# Altium schematic sheet 100068622_ideal_diode.SchDoc
size 863 x 558 mm; SheetNumber: 3; SheetTotal: 6
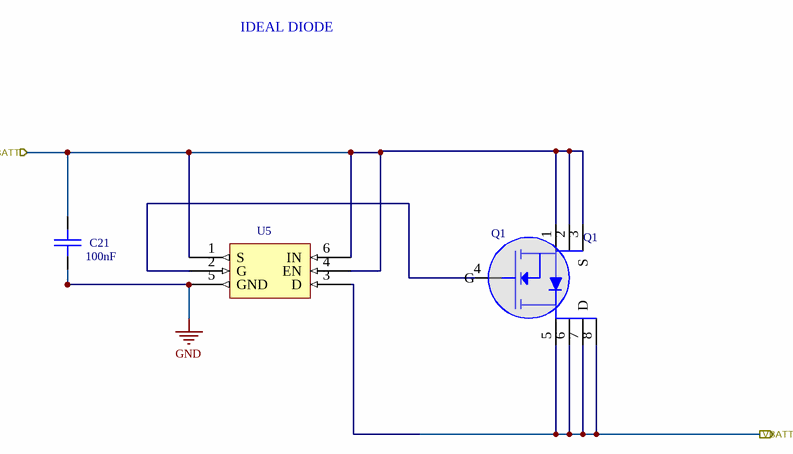
[diagram p0: 100068622_ideal_diode.SchDoc]

## Parts
C21  value 100nF  [CAP-0402-A]  (hidden comment: CAP 0402 0.1UF 50V 10% X5R)
Q1  MOSFET - SINGLE - N CHANNEL - 8PIN  [IC-8PQFN-A]  (value not drawn)
U5  NCV68261MTWAITBG  [IC-WDFN6-C]  (value not drawn)

## Ports
VBATT (in), VBATT_PROT (out)

## Nets
GND: C21.1 U5.5(GND)
VBATT: C21.2 Q1.1(S) Q1.2(S) Q1.3(S) U5.1(S) U5.4(EN) U5.6(IN) ; port VBATT
VBATT_PROT: Q1.5(D) Q1.6(D) Q1.7(D) Q1.8(D) U5.3(D) ; port VBATT_PROT
NetQ1_4: Q1.4(G) U5.2(G)

## Notes on the sheet
- IDEAL DIODE
- (near Q1) Q1
- DWG NO
- REVISIONS
- SH
- REVISION
- DESCRIPTION
- DATE(YEAR-MO-DA)
- APPROVED
- PART NO.
- DESIGN ACTIVITY
- US ARMY
  COMBAT CAPABILITIES DEVELOPMENT COMMAND ARMAMENTS CENTER
  PICATINNY ARSENAL, NEW JERSEY 07806-5000
- SIZE
- CAGE CODE
- DWG NO.
- D
- 19200
- SCALE
- NONE
- UNIT WT.
- ---
- SHEET

## Library data of the parts
C21 = CAP-00349-1: Capacitor Type: Ceramic; Leader Qty: 100; UOM: EA; Footprint: Capacitor_SMD:C_0402_1005Metric; Case/Package: 0402; Max Operating Temperature: 85°C; Min Operating Temperature: -55°C; Mounting Technology: Surface Mount; Pins: 2; RoHS Compliant: Yes; Tolerance: 10%; Voltage Rating: 50V
Q1 = CMP-00665-5: Transistor MOSFET N-Channel 40V 150A 8-Pin PQFN T/R; Manufacturer Lifecycle Status: ACTIVE; Drain to Source Resistance: 2.1mΩ; Gate to Source Voltage (Vgs): 20V; Max Junction Temperature (Tj): 150°C; Max Power Dissipation: 83W; Number of Channels: 1; Power Dissipation: 2.2W; Turn-Off Delay Time: 32ns; Turn-On Delay Time: 17ns; China RoHS: Non-Compliant; Continuous Drain Current (ID): 150A; Country of Origin: Philippines; Drain to Source Breakdown Voltage: 40V; Drain to Source Voltage (Vdss): 40V; Export Control Classification Number (ECCN) Code: EAR99; Height: 800µm; Introduction Date: 2019-11-12; Lifecycle Status: Production; Max Operating Temperature: 150°C; Min Breakdown Voltage: 40V; Min Operating Temperature: -55°C; Number of Elements: 1; Number of Terminals: 8; REACH SVHC: No; RoHS: Compliant; Schedule B: 8541290080, 8541290080
U5 = IC-00420-1: OR Controller N-Channel Single 2.4Ohm Automotive 6-Pin WDFNW EP T/R; Footprint: 1a_Misc:WDFNW6_2x2_0.65p_EP; China RoHS: Compliant; Export Control Classification Number (ECCN) Code: EAR99; Harmonized Tariff Schedule (HTS) Code: 8542.39.00.60; Introduction Date: 2022-02-25; Lifecycle Status: Production; REACH SVHC: Yes; RoHS: Compliant